# Altium schematic sheet WiringDiagram.SchDoc
size A
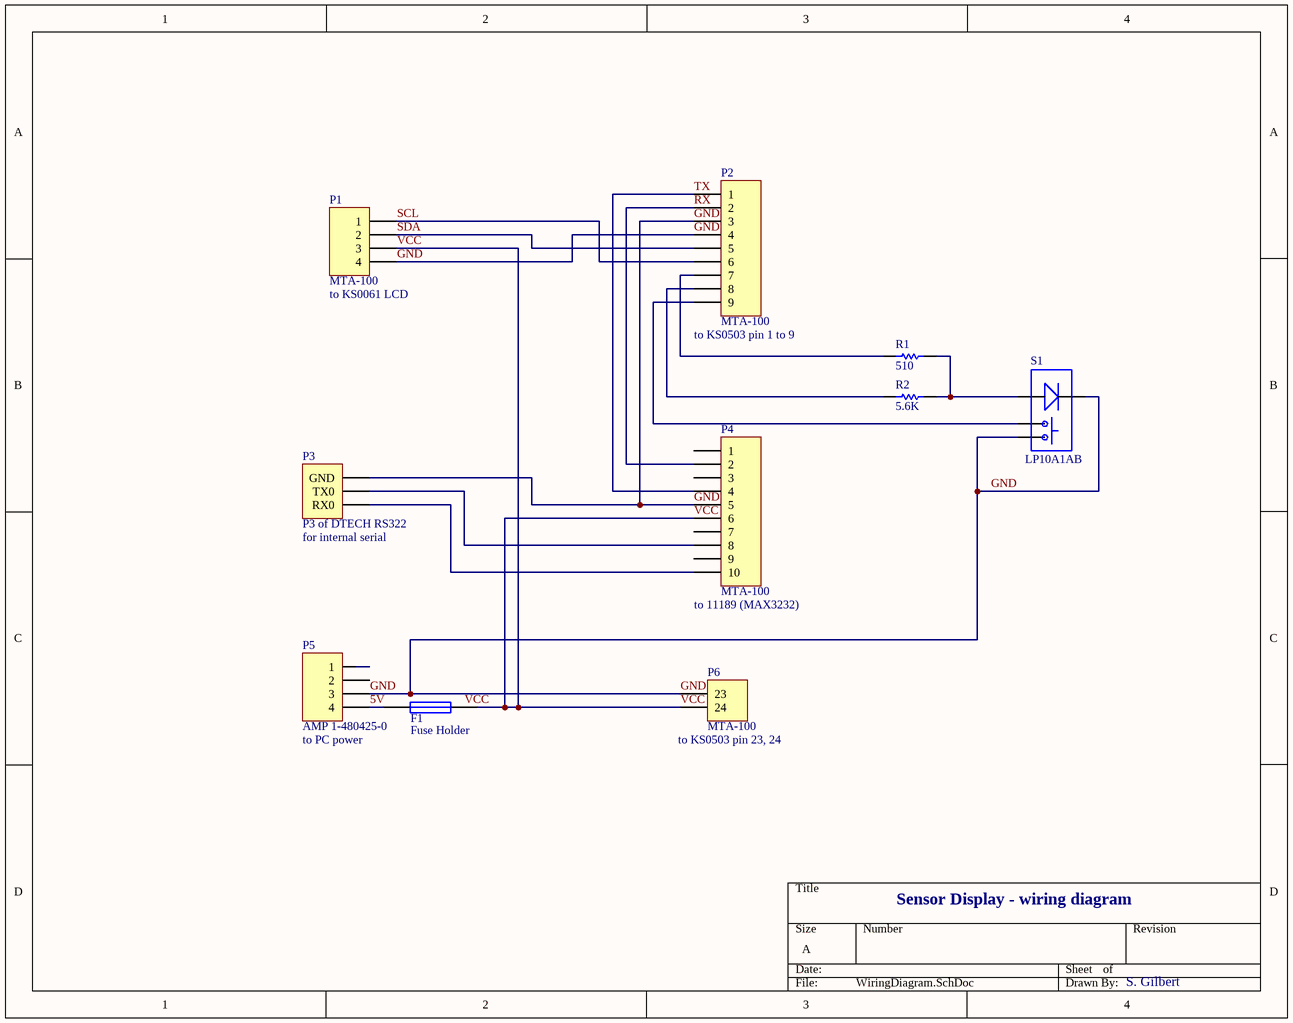
[diagram p0: WiringDiagram.SchDoc]

## Parts
F1  Fuse Holder  [PIN-W2/E2.8]
P1  MTA-100  Desc: to KS0061 LCD  [HDR1X4]
P2  MTA-100  Desc: to KS0503 pin 1 to 9  [HDR1X9]
P3  P3 of DTECH RS322  desc: for internal serial  [HDR1X3]
P4  MTA-100  Desc: to 11189 (MAX3232)  [HDR1X10]
P5  AMP 1-480425-0  Desc: to PC power  [HDR1X4]
P6  MTA-100  Desk: to KS0503 pin 23, 24  [HDR1X2]
R1  510  [AXIAL-0.3]
R2  5.6K  [AXIAL-0.3]
S1  LP10A1AB

## Nets
5V: F1.1 P5.4
GND: P1.4 P2.3 P2.4 P3.GND P4.5 P5.3 P6.23 S1.2(K) S1.4
RX: P2.2 P4.2
SCL: P1.1 P2.6
SDA: P1.2 P2.5
TX: P2.1 P4.4
VCC: F1.2 P1.3 P4.6 P6.24
NetP2_7: P2.7 R1.1
NetP2_8: P2.8 R2.1
NetP2_9: P2.9 S1.3
NetP3_RX0: P3.RX0 P4.10
NetP3_TX0: P3.TX0 P4.8
NetR1_2: R1.2 R2.2 S1.1(A)

Not connected (* = marked no-connect by the designer): P4 1 3 7 9; P5 1 2

## Notes on the sheet
- Sensor Display - wiring diagram
- S. Gilbert
- Labels drawn without touching a wire or pin: VCC

## Library data of the parts
F1 = Fuse 1: Fuse; Published: 8-Jun-2000; LatestRevisionDate: 17-Jul-2002; LatestRevisionNote: Re-released for DXP Platform.; PackageReference: PIN-W2/E2.8; Publisher: Altium Limited; PackageDescription: Thru-Hole; 2 Leads
P1 P5 = Header 4: Header, 4-Pin; LatestRevisionDate: 17-Jul-2002; LatestRevisionNote: Re-released for DXP Platform.; Publisher: Altium Limited
P2 = Header 9: Header, 9-Pin; LatestRevisionDate: 17-Jul-2002; LatestRevisionNote: Re-released for DXP Platform.; Publisher: Altium Limited
P3 = Header 3: Header, 3-Pin; LatestRevisionDate: 17-Jul-2002; LatestRevisionNote: Re-released for DXP Platform.; Publisher: Altium Limited
P4 = Header 10: Header, 10-Pin; LatestRevisionDate: 17-Jul-2002; LatestRevisionNote: Re-released for DXP Platform.; Publisher: Altium Limited
P6 = Header 2: Header, 2-Pin; LatestRevisionDate: 17-Jul-2002; LatestRevisionNote: Re-released for DXP Platform.; Publisher: Altium Limited
R1 = Res1: Resistor; Published: 8-Jun-2000; LatestRevisionDate: 17-Jul-2002; LatestRevisionNote: Re-released for DXP Platform.; PackageReference: AXIAL-0.3; Publisher: Altium Limited; PackageDescription: Axial Device, Thru-Hole; 2 Leads; 0.3 in Pin Spacing; Value: 510
R2 = Res1: Resistor; Value: 1K; Published: 8-Jun-2000; LatestRevisionDate: 17-Jul-2002; LatestRevisionNote: Re-released for DXP Platform.; PackageReference: AXIAL-0.3; Publisher: Altium Limited; PackageDescription: Axial Device, Thru-Hole; 2 Leads; 0.3 in Pin Spacing
S1 = Push_Button_led